# EAGLE schematic team throttle control draft 2 (EAGLE 7.7.0)
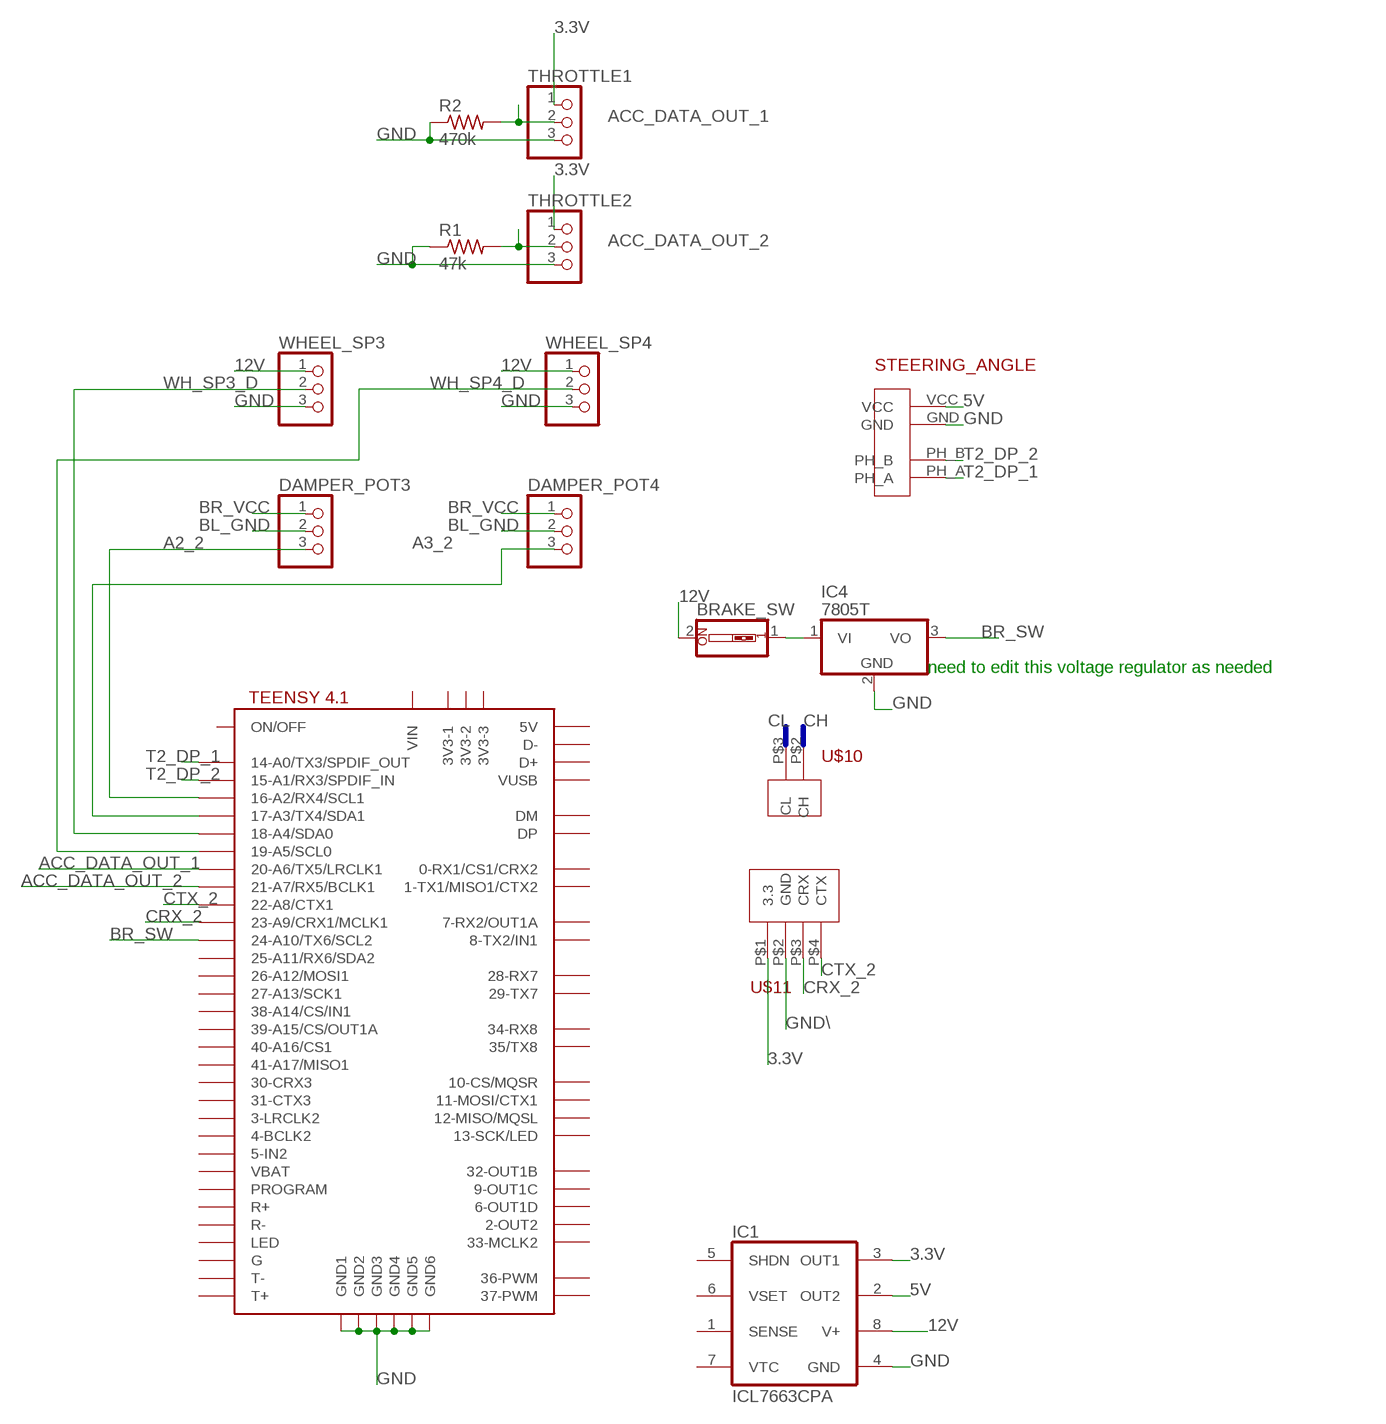
[diagram p0: schematic, sheet 1]

## Parts
BRAKE_SW  SW_DIP-1  [EDG-01]
DAMPER_POT3  PINHD-1X3CB  [1X03-CLEANBIG]
DAMPER_POT4  PINHD-1X3CB  [1X03-CLEANBIG]
IC1  ICL7663CPA  [DIL08]
IC4  7805T  [TO220H]
R1  47k  R-US_0204/7  [0204/7]
R2  470k  R-US_0204/7  [0204/7]
STEERING_ANGLE  ROTARY_ENCODER  [ROTARY_ENCODER]
THROTTLE1  PINHD-1X3  [1X03]
THROTTLE2  PINHD-1X3  [1X03]
U$3  TEENSY41  [TEENSY41]
U$10  CAN_BUS  [CAN_BUS]
U$11  CAN_TEE  [CAN_TEN]
WHEEL_SP3  PINHD-1X3  [1X03]
WHEEL_SP4  PINHD-1X3  [1X03]

## Nets
3.3V: IC1.3(OUT1) THROTTLE1.1 THROTTLE2.1 U$11.P$1(3.3)
5V: IC1.2(OUT2) STEERING_ANGLE.VCC
12V: BRAKE_SW.2 IC1.8(V+) WHEEL_SP3.1 WHEEL_SP4.1
A2_2: DAMPER_POT3.3 U$3.16-A2/RX4/SCL1
A3_2: DAMPER_POT4.3 U$3.17-A3/TX4/SDA1
ACC_DATA_OUT_1: R2.2 THROTTLE1.2 U$3.20-A6/TX5/LRCLK1
ACC_DATA_OUT_2: R1.2 THROTTLE2.2 U$3.21-A7/RX5/BCLK1
BL_GND: DAMPER_POT3.2 DAMPER_POT4.2
BR_SW: IC4.3(VO) U$3.24-A10/TX6/SCL2
BR_VCC: DAMPER_POT3.1 DAMPER_POT4.1
CRX_2: U$3.23-A9/CRX1/MCLK1 U$11.P$3(CRX)
CTX_2: U$3.22-A8/CTX1 U$11.P$4(CTX)
GND: IC1.4(GND) IC4.2(GND) R1.1 R2.1 STEERING_ANGLE.GND THROTTLE1.3 THROTTLE2.3 U$3.GND1 U$3.GND2 U$3.GND3 U$3.GND4 U$3.GND5 U$3.GND6 WHEEL_SP3.3 WHEEL_SP4.3
GND\: U$11.P$2(GND)
N$4: BRAKE_SW.1 IC4.1(VI)
T2_DP_1: STEERING_ANGLE.PH_A U$3.14-A0/TX3/SPDIF_OUT
T2_DP_2: STEERING_ANGLE.PH_B U$3.15-A1/RX3/SPDIF_IN
WH_SP3_D: U$3.18-A4/SDA0 WHEEL_SP3.2
WH_SP4_D: U$3.19-A5/SCL0 WHEEL_SP4.2
Unconnected: IC1.1(SENSE) IC1.5(SHDN) IC1.6(VSET) IC1.7(VTC) U$3.0-RX1/CS1/CRX2 U$3.1-TX1/MISO1/CTX2 U$3.2-OUT2 U$3.3-LRCLK2 U$3.3V3-1 U$3.3V3-2 U$3.3V3-3 U$3.4-BCLK2 U$3.5-IN2 U$3.6-OUT1D U$3.7-RX2/OUT1A U$3.8-TX2/IN2(8-TX2/IN1) U$3.9-OUT1C U$3.10-CS\MQSR(10-CS/MQSR) U$3.11-MOSI/CTX1 U$3.12-MISO/MQSL U$3.13-SCK/LED U$3.25-A11/RX6/SDA2 U$3.26-A12/MOSI1 U$3.27-A13/SCK1 U$3.28-RX7 U$3.29-TX7 U$3.30-CRX3 U$3.31-CTX3 U$3.32-OUT1B U$3.33-MCLK2 U$3.34-RX8 U$3.35-TX8(35/TX8) U$3.36-PWM U$3.37-PWM U$3.38-A14/CS/IN1 U$3.39-A15/CS/OUT1A U$3.40-A16/CS1 U$3.41-A17/MISO1 U$3.+5V(5V) U$3.D+ U$3.D- U$3.DM U$3.DP U$3.G U$3.LED U$3.ON/OFF U$3.PROGRAM U$3.R+ U$3.R- U$3.T+ U$3.T- U$3.VBAT U$3.VIN U$3.VUSB U$10.P$2(CH) U$10.P$3(CL)

## Buses
CL
CH

## Notes on the sheet
- need to edit this voltage regulator as needed

## Library data of the parts
BRAKE_SW = special:SW_DIP-1: DIP SWITCH
DAMPER_POT3 DAMPER_POT4 THROTTLE1 THROTTLE2 WHEEL_SP3 WHEEL_SP4 = adafruit:PINHD-1X3: PIN HEADER
IC1 = maxim:ICL7663CPA: Positive VOLTAGE REGULATOR; OC_FARNELL: unknown; OC_NEWARK: unknown
IC4 = adafruit:78*: Positive VOLTAGE REGULATOR Added bigger pads to the TO-92 package
R1 R2 = rcl:R-US_: RESISTOR, American symbol; SPICEPREFIX: R
STEERING_ANGLE = F-E library custom components:ROTARY_ENCODER
U$3 = teensy:TEENSY41
U$10 = F-E library custom components:CAN_BUS
U$11 = F-E library custom components:CAN_TEE